# Altium schematic sheet custom_pcb_schematic.schdoc
size 297 x 177 mm
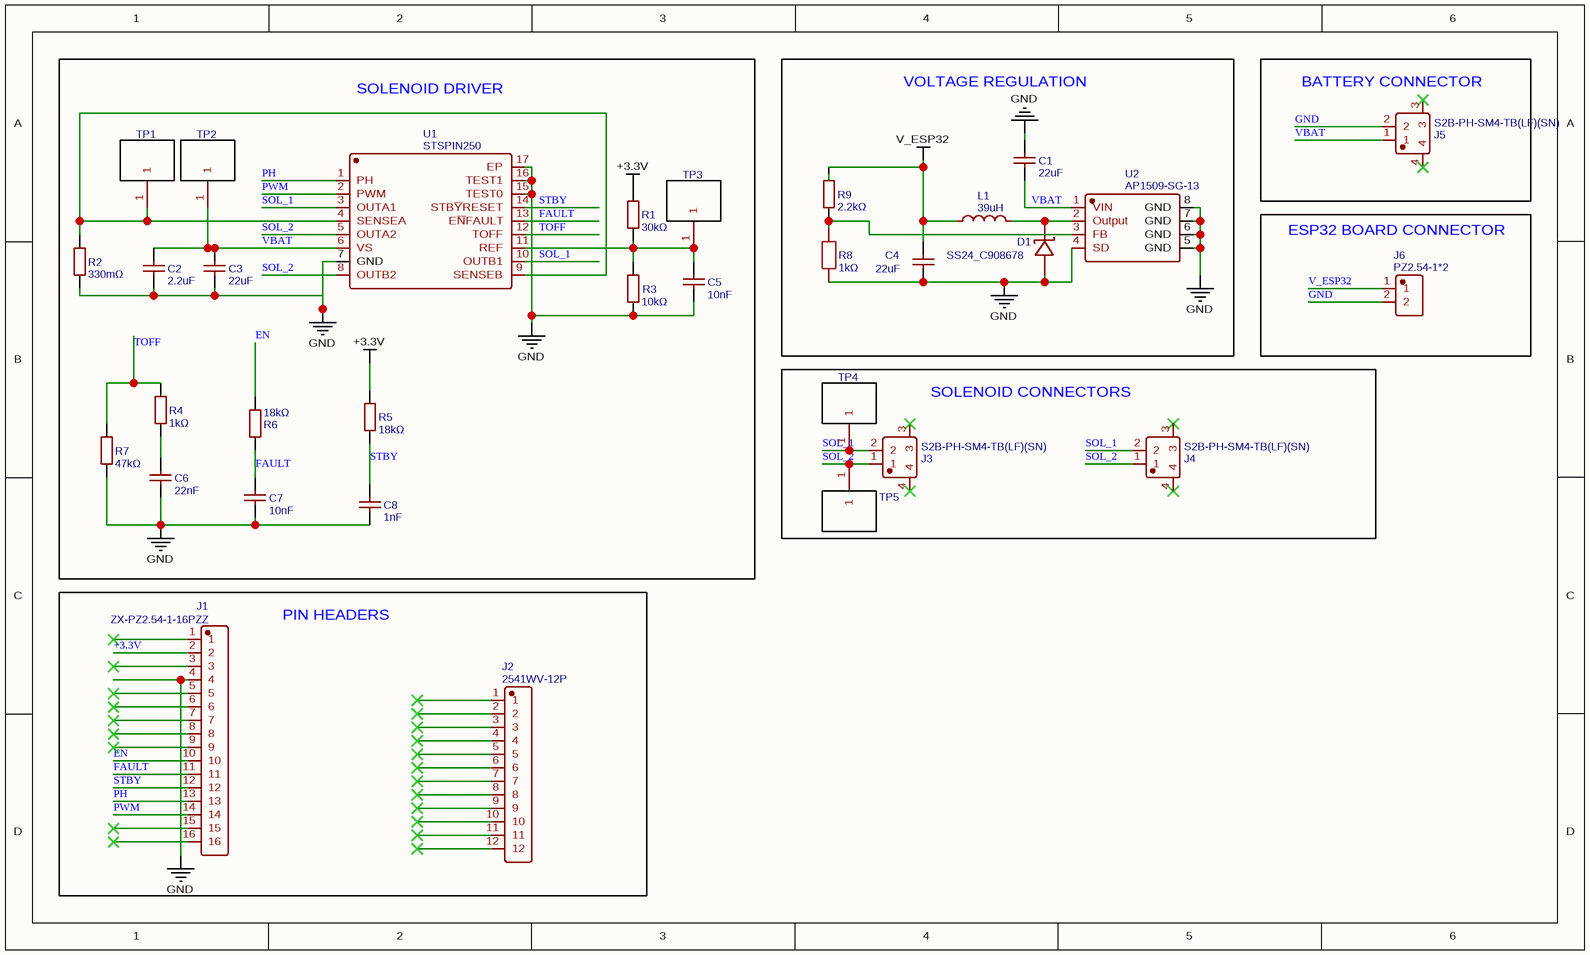
[diagram p0: custom_pcb_schematic.schdoc]

## Parts
C1  22uF  [C0805]
C2  2.2uF  [C0603]
C3  22uF  [C0805]
C4  22uF  [C0805]
C5  10nF  [C0603]
C6  22nF  [C0603]
C7  10nF  [C0603]
C8  1nF  [C0402]
D1  SS24_C908678  [SMA_L4.2-W2.7-LS5.1-RD]
J1  ZX-PZ2.54-1-16PZZ  [HDR-TH_16P-P2.54-V-M-2]
J2  2541WV-12P  [HDR-TH_12P-P2.54-V-M]
J3  S2B-PH-SM4-TB(LF)(SN)  [CONN-SMD_P2.00_S2B-PH-SM4-TB-LF-SN]
J4  S2B-PH-SM4-TB(LF)(SN)  [CONN-SMD_P2.00_S2B-PH-SM4-TB-LF-SN]
J5  S2B-PH-SM4-TB(LF)(SN)  [CONN-SMD_P2.00_S2B-PH-SM4-TB-LF-SN]
J6  PZ2.54-1*2  [HDR-TH_2P-P2.54-V-M-3]
L1  39uH  [IND-SMD_L10.1-W10.0]
R1  30kΩ  [R0402]
R2  330mΩ  [R2512]
R3  10kΩ  [R0603]
R4  1kΩ  [R0603]
R5  18kΩ  [R0402]
R6  18kΩ  [R0402]
R7  47kΩ  [R0402]
R8  1kΩ  [R0603]
R9  2.2kΩ  [R0402]
TP1  PG2.0-4.5-0.8T  [TESTPOINT-TH_PG2.0-4.5-0.8T]  (value not drawn)
TP2  PG2.0-4.5-0.8T  [TESTPOINT-TH_PG2.0-4.5-0.8T]  (value not drawn)
TP3  PG2.0-4.5-0.8T  [TESTPOINT-TH_PG2.0-4.5-0.8T]  (value not drawn)
TP4  PG2.0-4.5-0.8T  [TESTPOINT-TH_PG2.0-4.5-0.8T]  (value not drawn)
TP5  PG2.0-4.5-0.8T  [TESTPOINT-TH_PG2.0-4.5-0.8T]  (value not drawn)
U1  STSPIN250  [TQFN-16_L3.0-W3.0-P0.50-BL-EP1.7]
U2  AP1509-SG-13  [SOP-8_L4.9-W3.9-P1.27-LS6.0-BL]

## Blocks framed on the sheet
SOLENOID DRIVER: C2 C3 C5-C8 R1-R7 TP1-TP3 U1
VOLTAGE REGULATION: C1 C4 D1 L1 R8 R9 U2
BATTERY CONNECTOR: J5
ESP32 BOARD CONNECTOR: J6
SOLENOID CONNECTORS: J3 J4 TP4 TP5
PIN HEADERS: J1 J2

## Nets
+3.3V: J1.2 R1.2 R5.2
GND: C1.2 C2.1 C3.1 C4.1 C5.1 C6.1 C7.1 C8.1 D1.2(A) J1.4 J5.2 J6.2 R2.1 R3.1 R7.1 R8.1 U1.7(GND) U1.15(TEST0) U1.16(TEST1) U1.17(EP) U2.4(SD) U2.5(GND) U2.6(GND) U2.7(GND) U2.8(GND)
V_ESP32: C4.2 J6.1 L1.1 R9.2
EN: J1.10 R6.1
FAULT: C7.2 J1.11 R6.2 U1.13(E~{N}FAULT)
PH: J1.13 U1.1(PH)
PWM: J1.14 U1.2(PWM)
SOL_1: J3.2 J4.2 TP4.1 U1.3(OUTA1) U1.10(OUTB1)
SOL_2: J3.1 J4.1 TP5.1 U1.5(OUTA2) U1.8(OUTB2)
STBY: C8.2 J1.12 R5.1 U1.14(STB~{Y}RESET)
TOFF: R4.2 R7.2 U1.12(TOFF)
VBAT: C1.1 C2.2 C3.2 J5.1 TP2.1 U1.6(VS) U2.1(VIN)
NetC5_2: C5.2 R1.1 R3.2 TP3.1 U1.11(REF)
NetC6_2: C6.2 R4.1
NetD1_1: D1.1(K) L1.2 U2.2(Output)
NetR2_2: R2.2 TP1.1 U1.4(SENSEA) U1.9(SENSEB)
NetR8_2: R8.2 R9.1 U2.3(FB)

Not connected (* = marked no-connect by the designer): J1 1* 3* 5* 6* 7* 8* 9* 15* 16*; J2 1* 2* 3* 4* 5* 6* 7* 8* 9* 10* 11* 12*; J3 3* 4*; J4 3* 4*; J5 3* 4*

## Library data of the parts
C1 C3 C4 = 22uF: Manufacturer: SAMSUNG(三星); Manufacturer Part: CL21A226MOQNNNE; nameAlias: Value; Supplier: LCSC; Supplier Part: C98190; JLCPCB Part Class: Extended Part; spicePre: C; spiceSymbolName: CL21A226MOQNNNE
C2 = 2.2uF: Manufacturer Part: CL10A225KO8NNNC; Manufacturer: SAMSUNG(三星); nameAlias: Value; Supplier: LCSC; Supplier Part: C23630; JLCPCB Part Class: Basic Part; spicePre: C; spiceSymbolName: CL10A225KO8NNNC
C5 C7 = 10nF: Manufacturer Part: CL10B103KB8NNNC; Manufacturer: SAMSUNG(三星); nameAlias: Value; Supplier: LCSC; Supplier Part: C1589; JLCPCB Part Class: Extended Part; spicePre: C; spiceSymbolName: CL10B103KB8NNNC
C6 = 22nF: Manufacturer Part: CL10B223KB8NNNC; Manufacturer: SAMSUNG(三星); nameAlias: Value; Supplier: LCSC; Supplier Part: C21122; JLCPCB Part Class: Basic Part; spicePre: C; spiceSymbolName: CL10B223KB8NNNC
C8 = 1nF: Manufacturer: YAGEO(国巨); Manufacturer Part: CC0402KRX7R9BB102; nameAlias: Value; Contributor: LCSC; Supplier: LCSC; Supplier Part: C106205; JLCPCB Part Class: Extended Part; spicePre: C; spiceSymbolName: CC0402KRX7R9BB102
D1 = SS24_C908678: Manufacturer: GOODWORK(固得沃克); Manufacturer Part: SS24; Contributor: lcsc; Supplier: LCSC; Supplier Part: C908678; JLCPCB Part Class: Extended Part; spicePre: D; spiceSymbolName: SS24_C908678
J1 = ZX-PZ2.54-1-16PZZ: Manufacturer: Megastar(兆星); Contributor: lcsc; Supplier: LCSC; Supplier Part: C7501270; Manufacturer Part: ZX-PZ2.54-1-16PZZ; spicePre: U; spiceSymbolName: ZX-PZ2.54-1-16PZZ
J2 = 2541WV-12P: Manufacturer: HanElectricity(瀚源); Contributor: lcsc; Supplier: LCSC; Supplier Part: C5383118; Manufacturer Part: 2541WV-12P; spicePre: U; spiceSymbolName: 2541WV-12P
J3-J5 = S2B-PH-SM4-TB(LF)(SN): Manufacturer: JST; Contributor: LCSC; Supplier: LCSC; Supplier Part: C295747; Manufacturer Part: S2B-PH-SM4-TB(LF)(SN); JLCPCB Part Class: Extended Part; spicePre: C; spiceSymbolName: S2B-PH-SM4-TB(LF)(SN)
J6 = PZ2.54-1*2: Manufacturer: ZHOURI(洲日); Contributor: lcsc; Supplier: LCSC; Supplier Part: C5360898; Manufacturer Part: PZ2.54-1*2; JLCPCB Part Class: Extended Part; spicePre: U; spiceSymbolName: PZ2.54-1*2
L1 = 39uH: Manufacturer: YJYCOIN(益嘉源); Manufacturer Part: YDRH104R-390M; nameAlias: Value; Contributor: LCSC; Supplier: LCSC; Supplier Part: C339965; JLCPCB Part Class: Extended Part; spicePre: L; spiceSymbolName: YDRH104R-390M
R1 = 30kΩ: Manufacturer: YAGEO(国巨); Manufacturer Part: RC0402FR-0730KL; nameAlias: Value; Supplier: LCSC; Supplier Part: C138008; JLCPCB Part Class: Extended Part; spicePre: R; spiceSymbolName: RC0402FR-0730KL
R2 = 330mΩ: Manufacturer: UNI-ROYAL(厚声); Manufacturer Part: 25121WF330LT4E; nameAlias: Value; Supplier: LCSC; Supplier Part: C25468; JLCPCB Part Class: Extended Part; spicePre: R; spiceSymbolName: 25121WF330LT4E
R3 = 10kΩ: Manufacturer: UNI-ROYAL(厚声); Manufacturer Part: 0603WAF1002T5E; nameAlias: Value; Supplier: LCSC; Supplier Part: C25804; JLCPCB Part Class: Basic Part; spicePre: R; spiceSymbolName: 0603WAF1002T5E
R4 = 1kΩ: Manufacturer Part: RC0603FR-071KL; Manufacturer: YAGEO(国巨); nameAlias: Value; Supplier: LCSC; Supplier Part: C22548; JLCPCB Part Class: Extended Part; spicePre: R; spiceSymbolName: RC0603FR-071KL
R5 R6 = 18kΩ: Manufacturer: YAGEO(国巨); Manufacturer Part: RC0402FR-0718KL; nameAlias: Value; Supplier: LCSC; Supplier Part: C138044; JLCPCB Part Class: Extended Part; spicePre: R; spiceSymbolName: RC0402FR-0718KL
R7 = 47kΩ: Manufacturer: YAGEO(国巨); Manufacturer Part: RC0402FR-0747KL; nameAlias: Value; Supplier: LCSC; Supplier Part: C93943; JLCPCB Part Class: Extended Part; spicePre: R; spiceSymbolName: RC0402FR-0747KL
R8 = 1kΩ: Manufacturer: VO(翔胜); Manufacturer Part: SCR0603F1K; nameAlias: Value; Contributor: lcsc; Supplier: LCSC; Supplier Part: C3016283; JLCPCB Part Class: Extended Part; spicePre: R; spiceSymbolName: SCR0603F1K
R9 = 2.2kΩ: Manufacturer: YAGEO(国巨); Manufacturer Part: RC0402FR-072K2L; nameAlias: Value; Supplier: LCSC; Supplier Part: C114762; JLCPCB Part Class: Extended Part; spicePre: R; spiceSymbolName: RC0402FR-072K2L
TP1-TP5 = PG2.0-4.5-0.8T: Manufacturer: null; Contributor: LCSC; Package Display: No; Supplier: LCSC; Supplier Part: C2895402; Manufacturer Part: PG2.0-4.5-0.8T; JLCPCB Part Class: Extended Part; spicePre: U; spiceSymbolName: PG2.0-4.5-0.8T
U1 = STSPIN250: Manufacturer: ST(意法半导体); Contributor: LCSC; Supplier: LCSC; Manufacturer Part: STSPIN250; Supplier Part: C155561; JLCPCB Part Class: Extended Part; spicePre: U; spiceSymbolName: STSPIN250
U2 = AP1509-SG-13: Manufacturer: DIODES(美台); Contributor: lcsc; Supplier: LCSC; Supplier Part: C151822; Manufacturer Part: AP1509-SG-13; JLCPCB Part Class: Extended Part; spicePre: U; spiceSymbolName: AP1509-SG-13